# EAGLE design Adafrruit PCF8523 QT (EAGLE 9.6.2)
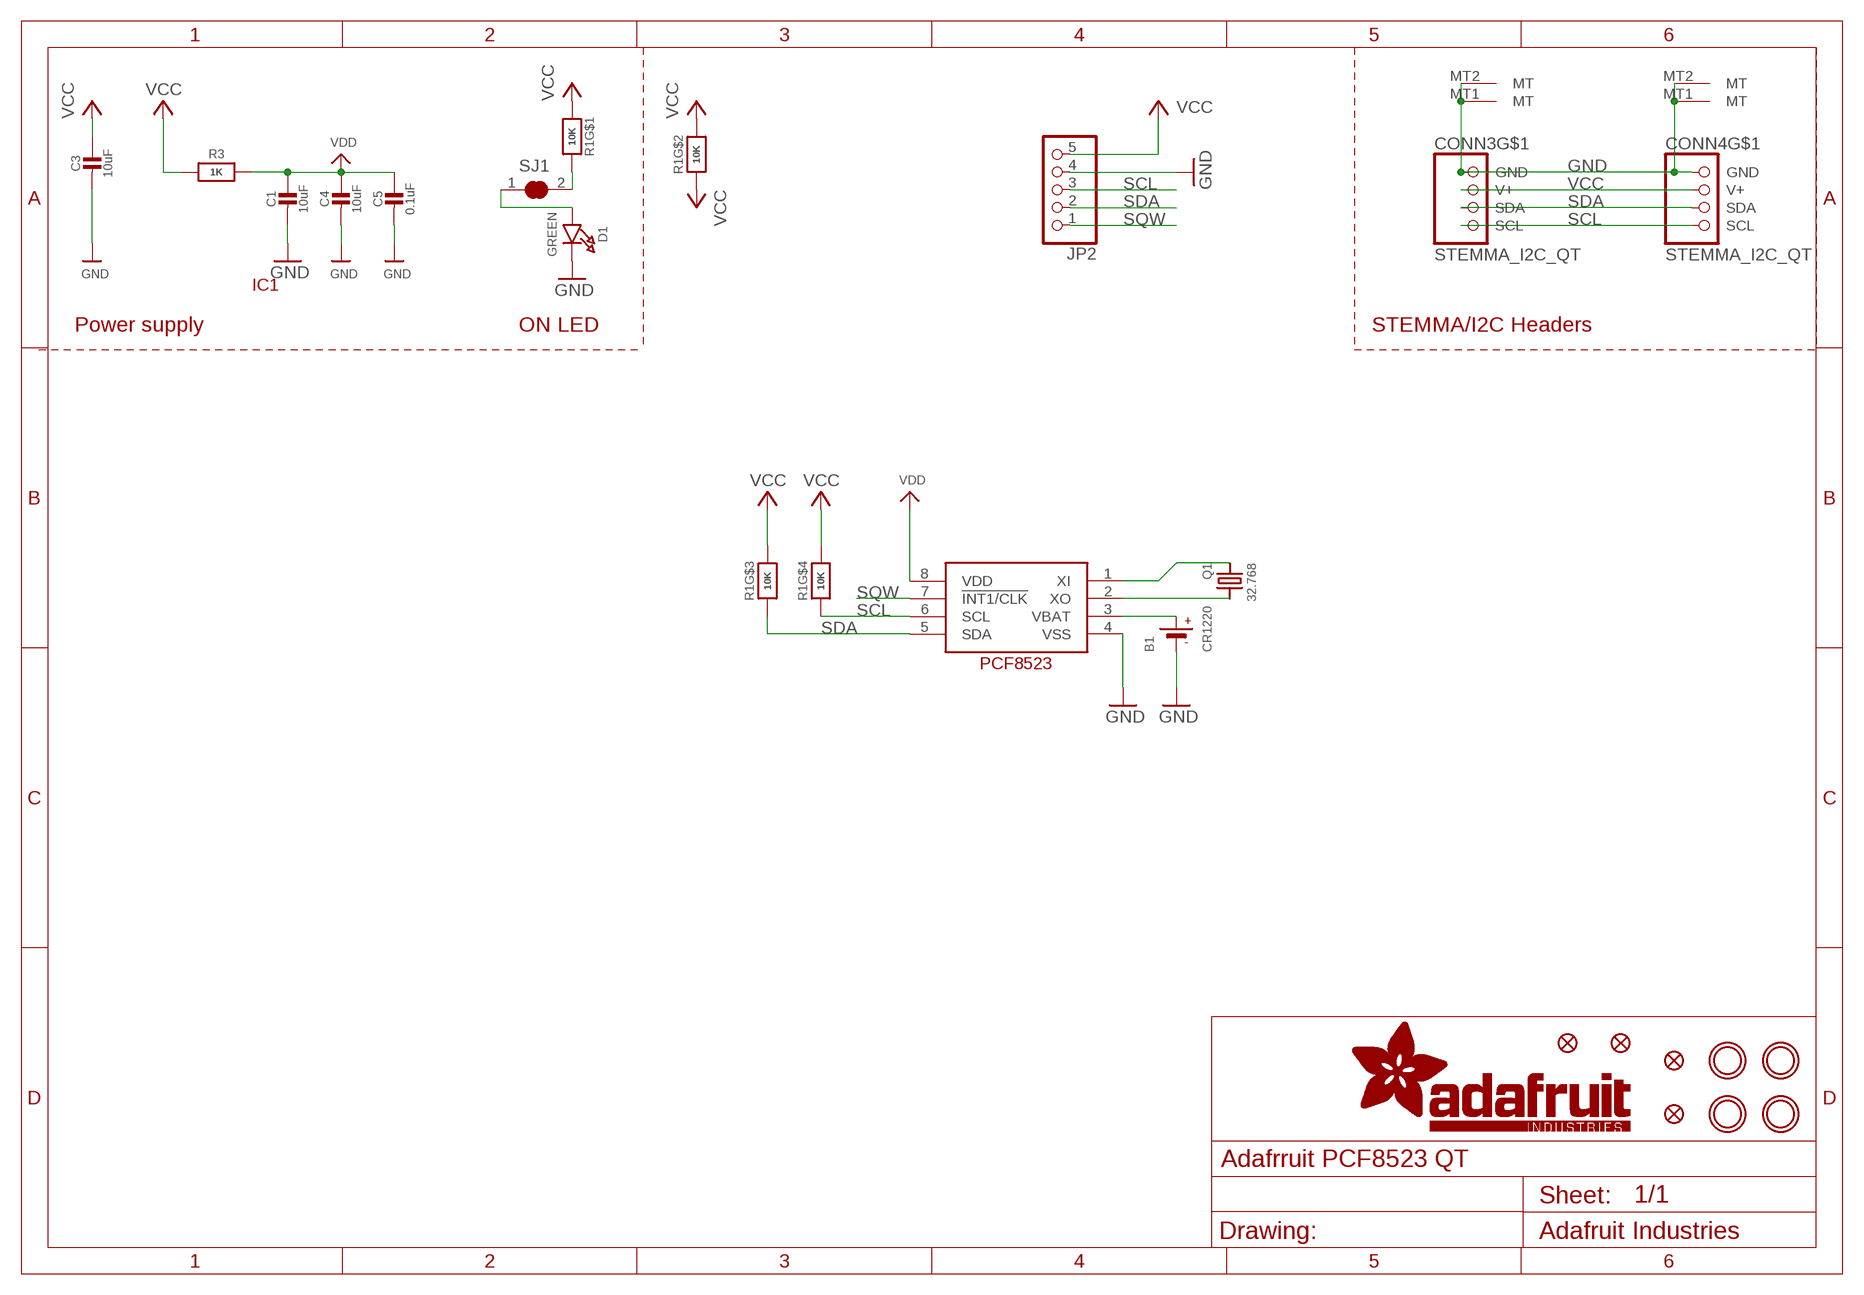
[diagram p0: schematic, sheet 1]

## Parts
B1  CR1220  BATTERYCR1220_SMT  [CR1220]
C1  10uF  CAP_CERAMIC0805-NOOUTLINE  [0805-NO]
C3  10uF  CAP_CERAMIC0805-NOOUTLINE  [0805-NO]
C4  10uF  CAP_CERAMIC0805-NOOUTLINE  [0805-NO]
C5  0.1uF  CAP_CERAMIC0603_NO  [0603-NO]
CONN3  STEMMA_I2C_QT  [JST_SH4]
CONN4  STEMMA_I2C_QT  [JST_SH4]
D1  GREEN  LED0603_NOOUTLINE  [CHIPLED_0603_NOOUTLINE]
FID1  FIDUCIAL_1MM  [FIDUCIAL_1MM]
FID2  FIDUCIAL_1MM  [FIDUCIAL_1MM]
FID3  FIDUCIAL_1MM  [FIDUCIAL_1MM]
FID4  FIDUCIAL_1MM  [FIDUCIAL_1MM]
IC1  RTC_PCF8523T  [SOIC8_150MIL]
JP2  HEADER-1X570MIL  [1X05_ROUND_70]
Q1  32.768  CRYSTAL_3215  [XTAL3215]
R1  10K  RESISTOR_4PACK  [RESPACK_4X0603]
R3  1K  RESISTOR_0603_NOOUT  [0603-NO]
SJ1  SOLDERJUMPER_CLOSED  [SOLDERJUMPER_CLOSEDWIRE]
U$9  MOUNTINGHOLE3.0THIN  [MOUNTINGHOLE_3.0_PLATEDTHIN]
U$17  MOUNTINGHOLE3.0THIN  [MOUNTINGHOLE_3.0_PLATEDTHIN]
U$19  MOUNTINGHOLE3.0THIN  [MOUNTINGHOLE_3.0_PLATEDTHIN]
U$21  MOUNTINGHOLE3.0THIN  [MOUNTINGHOLE_3.0_PLATEDTHIN]

## Nets
GND: B1.- C1.2 C3.2 C4.2 C5.2 CONN3.1(GND) CONN3.MT1(MT) CONN3.MT2(MT) CONN4.1(GND) CONN4.MT1(MT) CONN4.MT2(MT) D1.C IC1.4(VSS) JP2.4
N$1: R1.8 SJ1.2
N$4: D1.A SJ1.1
N$14: IC1.1(XI) Q1.P$1
N$15: IC1.2(XO) Q1.P$2
SCL: CONN3.4(SCL) CONN4.4(SCL) IC1.6(SCL) JP2.3 R1.4
SDA: CONN3.3(SDA) CONN4.3(SDA) IC1.5(SDA) JP2.2 R1.3
SQW: IC1.7(!INT1/CLK) JP2.1
VBAT: B1.+$1(+) B1.+$2(+) IC1.3(VBAT)
VCC: C3.1 CONN3.2(V+) CONN4.2(V+) JP2.5 R1.1 R1.2 R1.5 R1.6 R1.7 R3.1
VDD: C1.1 C4.1 C5.1 IC1.8(VDD) R3.2

## Notes on the sheet
- Power supply | ON LED | STEMMA/I2C Headers

## Library data of the parts
B1 = microbuilder:BATTERY: CR1220 SMT - Digikey: 3001K-ND CD2032 BAT-HLD-001 - Digikey: BAT-HLD-001-ND
C1 C3-C5 = microbuilder:CAP_CERAMIC: Ceramic Capacitors For new designs, use the packages preceded by an '_' character since they are more reliable: The following footprints should be used on most boards: _0402 - Standard footprint for regular board layouts _0603 - Standard footprint for regular board layouts _0805 - Standard footprint for regular board layouts _1206 - Standard footprint for regular board layouts For extremely tight-pitch boards where space is at a premium, the following 'micro-pitch' footprints can be used (smaller pads, no silkscreen outline, etc.): _0402MP - Micro-pitch footprint for very dense/compact boards _0603MP - Micro-pitch footprint for very dense/compact boards _0805MP - Micro-pitch footprint for very dense/compact boards _1206MP - Micro-pitch footprint for very dense/compact boards
CONN3 CONN4 = microbuilder:STEMMA_I2C
D1 = microbuilder:LED: LED 0603 - 0603 Surface Mount Package 2mA: Green LED - Low Power (3.9mcd, 2ma, 1.7Vf) - Digikey: 475-2709-2-ND Orange LED - Low Power (9.8mcd, 2ma, 1.8Vf) - Digikey: 475-1194-2-ND Red LED - Low Power (5mcd, 2ma, 1.8Vf) - Digikey: 475-1195-2-ND Yellow LED - Low Power (7mcd, 2ma, 1.8Vf) - Digikey: 475-1196-2-ND 5mA: Blue LED - Low Power (17mcd, 5ma, 2.9Vf) - Digikey: LNJ937W8CRACT-ND 0805 - 0805 Surface Mount Package 2mA: Red LED (8.8mcd, 2mA, 1.8Vf, Clear) - Low Power [Digikey: 475-2510-1-ND] Green LED (5mcd, 2mA, 1.8Vf, Clear) - Low Power [Digikey: 475-2730-1-ND] Yellow LED (11.3mcd, 2mA, 1.8Vf, Clear) - Low Power [Digikey: 475-2555-1-ND] 20mA: Red LED (104mcd, 20mA, Diffused) - LS R976 [Digikey: 475-1278-6-ND] Red LED (12mcd, 20mA, 2.0Vf, Clear) - APT2012EC [Digikey: 754-1128-1-ND] Green LED (15mcd, 20mA, 2.2Vf, Clear) - APT2012GC [Digikey: 754-1131-1-ND] Orange LED (160mcd, 20mA, 2.1Vf, Clear) - APT2012SECK [Digikey: 754-1130-1-ND] 1206 - 1206 Surface Mount Package Green LED (26mcd, 20mA, Diffused) - LG N971 [Digikey: 475-1407-6-ND] Red LED (15mcd, 20mA, Diffused) - LH N974 [Digikey: 475-1416-6-ND] Cree - Cree High-Power Surface Mount LEDs XPEBWT-L1-0000-00D50 - White 111lm 350mA 2.9Vf 6200K 110° XTEAWT-00-0000-00000LEE3 - White 114lm 350mA 2.85Vf 5000K 115° Everlight - Everlight 45-21 Series Surface Mount LEDs 45-21/QK2C-B2832AC2CB2/2T - Warm White 2000mcd 20mA 3.25Vf 3050K 120° 45-21/LK2C-B38452C4CB2/2T - Nuetral White 2000mcd 20mA 3.25Vf 4150K 120° 45-21/LK2C-B50634C6CB2/2T - Cold White 2200mcd 20mA 3.25Vf 5650K 120° PLCC2 Reverse Mount LS T77K-J1L2-1-0-2-R18-Z - Red 11.25mcd 2mA 1.8Vf 630nm 120° LO T77K-L1M2-24-Z - Orange 19.6mcd 2mA 1.8Vf 606nm 120° LY T77K-K2M1-26-Z - Yellow 15.7mcd 2mA 1.8Vf 587nm 120°
FID1-FID4 = microbuilder:FIDUCIAL: Fiducial Alignment Points Various fiducial points for machine vision alignment.; BOM: EXCLUDE
IC1 = microbuilder:RTC_PCF8523
JP2 = microbuilder:HEADER-1X5: PIN HEADER
Q1 = microbuilder:CRYSTAL: Crystals HC49UP - Surface Mount Crystal 4.0MHz 18pF +/-30ppm Surface Mount Crystal [Digikey: 535-9857-1-ND] 12.0 MHz Surface Mount Crystal [Digikey: 535-9869-6-ND] 25.0 MHz Surface Mount Crystal [Digikey: 535-9078-1-ND] 2.5 x 2.0mm - MEMs SMT Crystal 16.0 MHz 10pF 20ppm 2.5 x 2.0mm Crystal [Digikey -40-85°C: 535-10923-1-ND] 3.2 x 2.5mm - MEMs SMT Crystal 12.0 MHz 8pF 15ppm 3.2 x 2.5mm Crystal [Digikey: -10-70°C: 644-1047-1-ND -40-125°C: 644-1128-1-ND] 40~85°C cheaper: 644-1173-6-ND 16.0 MHz 8pF 15ppm 3.2 x 2.5mm Crystal [Digikey: -10-70°C: 644-1049-1-ND -40-125°C: 644-1129-2-ND]-40~85°C cheaper: 644-1175-6-ND 16.0 MHz 10pF 10ppm 3.2 x 2.5mm Crystal [Digikey: 644-1100-1-ND] 27.12 MHz 18pF 30ppm 3.2 x 2.5mm Crystal [Digikey: 887-1424-1-ND] 27.12MHz 10pF 10ppm 3.2 x 2.5mm Crystal [Digikey: 887-1329-1-ND] 4.9 x 1.8mm - MEMs SMT Crystal 32.768 KHz 12.5pF 20ppm 4.9 x 1.8mm Crystal [Digikey: SE2415CT-ND] 8.0 x 3.8mm - Surface Mount Crystal 32.768kHz 12.5pF 20ppm -40°C-85°C [Digikey: 535-9166-2-ND] Cylinder 32.768KHz Cylinder Crystal (2x6mm body) [Ex. Digikey: 300-8341-2-ND]
R1 = microbuilder:RESISTOR_4PACK: Resistor Packs (4 resistors) 4 x 0603 10K 1/16W - Digikey: YC164J-10KCT-ND
R3 = microbuilder:RESISTOR: Resistors For new designs, use the packages preceded by an '_' character since they are more reliable: The following footprints should be used on most boards: _0402 - Standard footprint for regular board layouts _0603 - Standard footprint for regular board layouts _0805 - Standard footprint for regular board layouts _1206 - Standard footprint for regular board layouts For extremely tight-pitch boards where space is at a premium, the following 'micro-pitch' footprints can be used (smaller pads, no silkscreen outline, etc.): _0402MP - Micro-pitch footprint for very dense/compact boards _0603MP - Micro-pitch footprint for very dense/compact boards _0805MP - Micro-pitch footprint for very dense/compact boards _1206MP - Micro-pitch footprint for very dense/compact boards
SJ1 = microbuilder:SOLDERJUMPER_CLOSED: Solder Jumper - Closed These solder jumpers are closed by default CLOSEDWIRE - 10 mil trace between pads that can be cut and resoldered later CLOSEDPERM - 63 mil trace between pads for a permanent connection (used to 'bridge' two signals, a shameless hack for Eagle). Can double as a test point as well (no cream layer)
U$9 U$17 U$19 U$21 = adafruit_electromech:MOUNTINGHOLE: Mounting Hole For #2 screws (0.086"/2.18mm width, 0.094"/2.4mm hole) use 2.5mm; BOM: EXCLUDE

## Net classes
1 highpower: width 0.305 mm, drill 0.483 mm
2 lowpower: width 0.254 mm, drill 0.483 mm

## Board
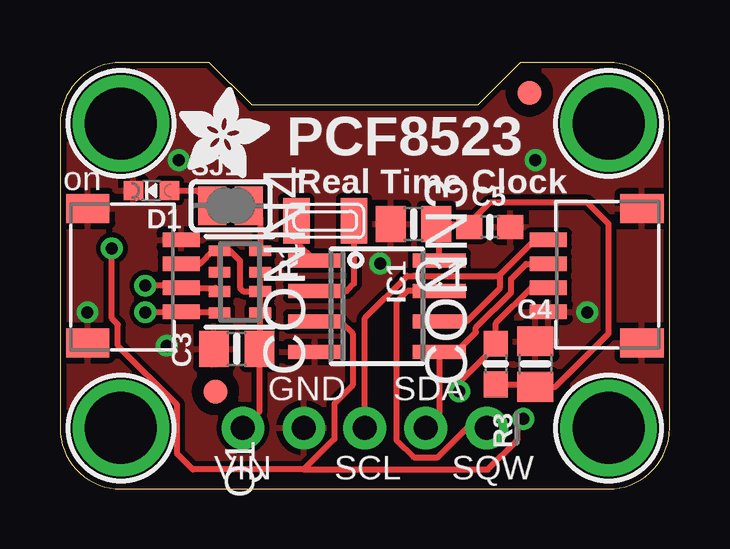
[diagram p1: board, top side]
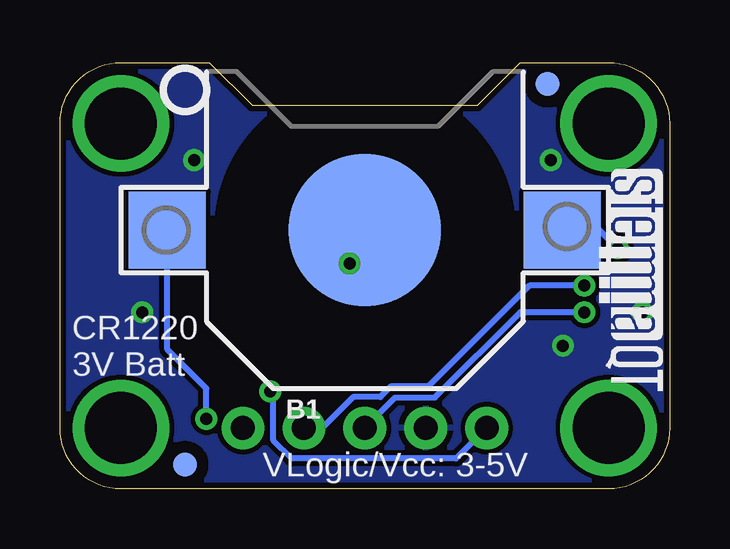
[diagram p2: board, bottom side, seen from below]

Size 25.4 x 17.78 mm. Coordinates in mm from the lower left corner, seen from the top.
Outline: 0,15.24 0,2.54 arc90 2.54,0 22.86,0 arc90 25.4,2.54 25.4,15.24 arc90 22.86,17.78 19.18,17.78 17.4,16 8,16 6.22,17.78 2.54,17.78 arc90 0,15.24
Copper layers (1*16): Top 0.035mm / dielectric 1.5mm / Bottom 0.035mm
Design rules "adafruit *": minimum track width 8mil, minimum drill 15.5mil, track to track 8mil, track to pad 8mil, pad to pad 8mil, via to via 8mil, smd to smd 8mil, copper to edge 10mil, drill to drill 8mil, minimum pad ring 10mil, minimum via ring 8mil, stop-mask expansion 2mil, vias tented up to drill 20mil, thermal gap 10mil

### Footprints (pad centres in the part's own frame; a part is rotated, then mirrored left to right if it is on the bottom)
CR1220 = smd 3.2 x 3.2: +$1 -8.225,0; +$2 8.225,0 | smd 6.35 x 6.35: - 0,0
0805-NO = smd 1.24 x 1.5: 1 -0.95,0; 2 0.95,0
0603-NO = smd 1.075 x 1: 1 -0.85,0; 2 0.85,0
JST_SH4 = smd 0.6 x 1.55: 1 -1.5,2.514; 2 -0.5,2.514; 3 0.5,2.514; 4 1.5,2.514 | smd 1.2 x 1.8: MT1 -2.8,-1.386; MT2 2.8,-1.386
CHIPLED_0603_NOOUTLINE = smd 0.8 x 0.8: A 0,-0.75; C 0,0.75
FIDUCIAL_1MM = smd 1 x 1: 1 0,0
SOIC8_150MIL = smd 0.6 x 2.2: 1 -1.905,-2.6; 2 -0.635,-2.6; 3 0.635,-2.6; 4 1.905,-2.6; 5 1.905,2.6; 6 0.635,2.6; 7 -0.635,2.6; 8 -1.905,2.6
1X05_ROUND_70 = drill 1 pad 1.778: 1 -5.08,0; 2 -2.54,0; 3 0,0; 4 2.54,0; 5 5.08,0
XTAL3215 = smd 1.1 x 1.9: P$1 1.2,0; P$2 -1.2,0
RESPACK_4X0603 = smd 0.45 x 0.9: 1 -1.3,-0.85; 2 -0.4,-0.85; 3 0.4,-0.85; 4 1.3,-0.85; 5 1.3,0.85; 6 0.4,0.85; 7 -0.4,0.85; 8 -1.3,0.85
SOLDERJUMPER_CLOSEDWIRE = smd 1.168 x 1.6: 1 -0.762,0; 2 0.762,0 | smd 0.635 x 0.203: WIRE 0,0
MOUNTINGHOLE_3.0_PLATEDTHIN = drill 3 pad 3.6: P$1 0,0

### Placement (x,y rotation side)
B1  12.7,10.79 0 bottom
C1  14.73,11.05 180 top
C3  7.37,5.84 180 top
C4  19.81,5.21 90 top
C5  17.91,10.92 0 top
CONN3  22.86,8.89 90 top
CONN4  2.54,8.89 270 top
D1  3.81,12.45 90 top
FID1  5.08,16.89 0 bottom
FID2  20.19,1.02 0 bottom
FID3  6.48,4.06 0 top
FID4  19.56,16.51 0 top
IC1  13.21,7.62 270 top
JP2  12.7,2.54 180 top
Q1  11.05,11.18 180 top
R1  7.49,8.64 270 top
R3  18.16,5.21 270 top
SJ1  7.11,11.81 0 top
U$9  2.54,15.24 0 top
U$17  22.86,15.24 0 top
U$19  2.54,2.54 0 top
U$21  22.86,2.54 0 top
U$22  [ADAFRUIT_3.5MM]  4.95,12.95 0 top
U$25  [PCBFEAT-REV-040]  20.19,16.64 0 bottom
U$31  [STEMMAQT]  2.92,13.34 270 bottom

### Tracks (layer width: path | path; a pad name or v marks a point on that pad's centre or on a via)
GND  (via drill 0.5)
  Bottom 0.254: B1.- 13.34,10.79 v13.34,9.4
  other vias: 4.45,5.97 1.14,7.37 4.95,13.72 19.81,13.72 21.97,7.37
  pour Top: 0,17.78 25.4,17.78 25.4,0 0,0
  pour Bottom: 0,17.78 25.4,17.78 25.4,0 0,0
N$1
  Top 0.254: SJ1.2 8.34,11.34 R1.8
N$4
  Top 0.254: D1.A 5.71,12.45 SJ1.1
N$14
  Top 0.254: Q1.P$1 9.85,10.28 IC1.1
N$15
  Top 0.254: Q1.P$2 12.25,8.57 11.94,8.26 IC1.2
SCL  (via drill 0.5)
  Top 0.254: IC1.6 16.94,6.99 18.34,8.39 18.34,8.89 | 18.34,8.89 18.34,8.95 19.78,10.39 CONN3.4 | R1.4 6.59,7.39 CONN4.4 5.03,7.37 v3.56,7.37 | JP2.3 12.7,7.12 14.46,8.88 14.73,8.88 14.73,8.89 18.34,8.89
  Bottom 0.254: JP2.3 11.43,3.81 9.78,3.81 6.22,7.37 v3.56,7.37
SDA  (via drill 0.5)
  Top 0.254: CONN3.3 19.42,9.39 18.8,8.76 18.8,8.2 17.33,6.73 17.33,6.54 16.51,5.71 IC1.5 15.81,2.79 15.55,2.54 JP2.2 | R1.3 6.49,8.39 CONN4.3 4.97,8.48 v3.56,8.48
  Bottom 0.254: v3.56,8.48 5.84,8.48 10.05,4.27 11.62,4.27 12.05,3.83 13.18,3.83 14.48,2.54 JP2.2
SQW
  Top 0.254: IC1.7 14.48,8.26 14.02,7.8 14.02,2.04 14.73,1.32 15.74,1.32 16.96,2.54 JP2.1
VBAT  (via drill 0.5)
  Top 0.254: IC1.3 11.68,6.99 12.19,6.48 12.19,4.32 11.43,3.56 11.43,2.09 10.16,0.81 | 10.16,0.81 5.54,0.81 4.88,1.47 4.88,3.51 2.41,5.97 2.41,6.86 2.16,7.11 v2.16,10.03 | 10.16,0.81 17.83,0.81 19.05,2.03 19.05,2.67 v19.3,2.92
  Bottom 0.254: v2.16,10.03 2.92,10.79 B1.+$2 | v19.3,2.92 19.3,4.19 20.93,5.81 B1.+$1
VCC  (via drill 0.5)
  Top 0.203: R1.1 R1.2 | R1.7 R1.6
  Top 0.254: CONN4.2 5.83,9.39 6.38,9.94 R1.1 7.08,9.94 7.49,9.53 7.49,8.38 7.64,8.24 R1.6 R1.5 8.32,7.31 C3.1 8.32,3.24 JP2.5 | CONN3.2 19.64,8.39 18.16,6.92 R3.1 18.16,5.97 16.64,4.45 v16.64,4.06
  Bottom 0.254: JP2.5 8.89,1.27 15.75,1.27 16.51,2.03 16.51,3.94 v16.64,4.06
VDD
  Top 0.254: IC1.8 15.81,10.92 C1.1 17.06,11.05 | R3.2 19.71,4.36 C4.1 20.64,4.26 22.86,6.48 22.86,11.05 21.97,11.94 17.91,11.94 17.06,11.09 17.06,11.05 | 17.06,11.05 C5.1

### Text on the board
tPlace: PCF8523 | Real Time Clock | on | GND | SDA | VIN | SCL | SQW
bPlace: CR1220 / 3V Batt | VLogic/Vcc: 3-5V